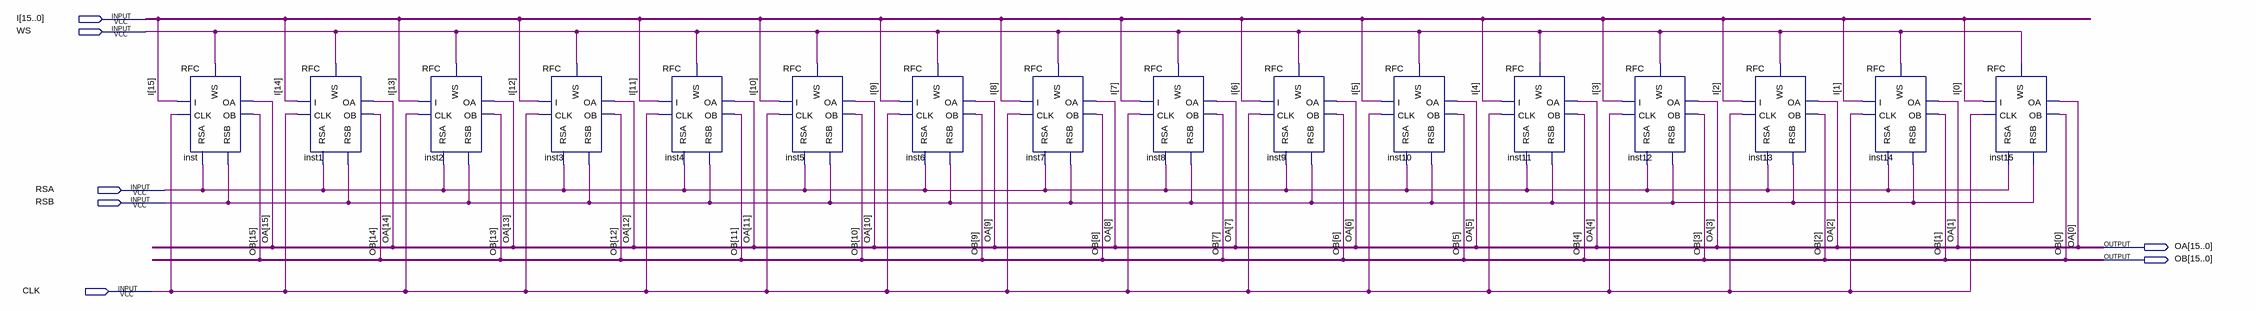
[diagram p0: schematic sheet]
// Quartus schematic ThanhGhi16bit.bdf as structural Verilog: 16 symbols, 7 pins
module ThanhGhi16bit (
  input  [15:0] I,
  input  WS,
  input  RSA,
  input  RSB,
  input  CLK,
  output [15:0] OA,
  output [15:0] OB
);

  RFC inst (.RSA(RSA), .WS(WS), .RSB(RSB), .I(I[15]), .CLK(CLK), .OA(OA[15]), .OB(OB[15]));
  RFC inst1 (.RSA(RSA), .WS(WS), .RSB(RSB), .I(I[14]), .CLK(CLK), .OA(OA[14]), .OB(OB[14]));
  RFC inst2 (.RSA(RSA), .WS(WS), .RSB(RSB), .I(I[13]), .CLK(CLK), .OA(OA[13]), .OB(OB[13]));
  RFC inst3 (.RSA(RSA), .WS(WS), .RSB(RSB), .I(I[12]), .CLK(CLK), .OA(OA[12]), .OB(OB[12]));
  RFC inst4 (.RSA(RSA), .WS(WS), .RSB(RSB), .I(I[11]), .CLK(CLK), .OA(OA[11]), .OB(OB[11]));
  RFC inst5 (.RSA(RSA), .WS(WS), .RSB(RSB), .I(I[10]), .CLK(CLK), .OA(OA[10]), .OB(OB[10]));
  RFC inst6 (.RSA(RSA), .WS(WS), .RSB(RSB), .I(I[9]), .CLK(CLK), .OA(OA[9]), .OB(OB[9]));
  RFC inst7 (.RSA(RSA), .WS(WS), .RSB(RSB), .I(I[8]), .CLK(CLK), .OA(OA[8]), .OB(OB[8]));
  RFC inst8 (.RSA(RSA), .WS(WS), .RSB(RSB), .I(I[7]), .CLK(CLK), .OA(OA[7]), .OB(OB[7]));
  RFC inst9 (.RSA(RSA), .WS(WS), .RSB(RSB), .I(I[6]), .CLK(CLK), .OA(OA[6]), .OB(OB[6]));
  RFC inst10 (.RSA(RSA), .WS(WS), .RSB(RSB), .I(I[5]), .CLK(CLK), .OA(OA[5]), .OB(OB[5]));
  RFC inst11 (.RSA(RSA), .WS(WS), .RSB(RSB), .I(I[4]), .CLK(CLK), .OA(OA[4]), .OB(OB[4]));
  RFC inst12 (.RSA(RSA), .WS(WS), .RSB(RSB), .I(I[3]), .CLK(CLK), .OA(OA[3]), .OB(OB[3]));
  RFC inst13 (.RSA(RSA), .WS(WS), .RSB(RSB), .I(I[2]), .CLK(CLK), .OA(OA[2]), .OB(OB[2]));
  RFC inst14 (.RSA(RSA), .WS(WS), .RSB(RSB), .I(I[1]), .CLK(CLK), .OA(OA[1]), .OB(OB[1]));
  RFC inst15 (.RSA(RSA), .WS(WS), .RSB(RSB), .I(I[0]), .CLK(CLK), .OA(OA[0]), .OB(OB[0]));
endmodule
